# Altium schematic sheet Battery Mgmt Sys - AMS.SchDoc
size A4
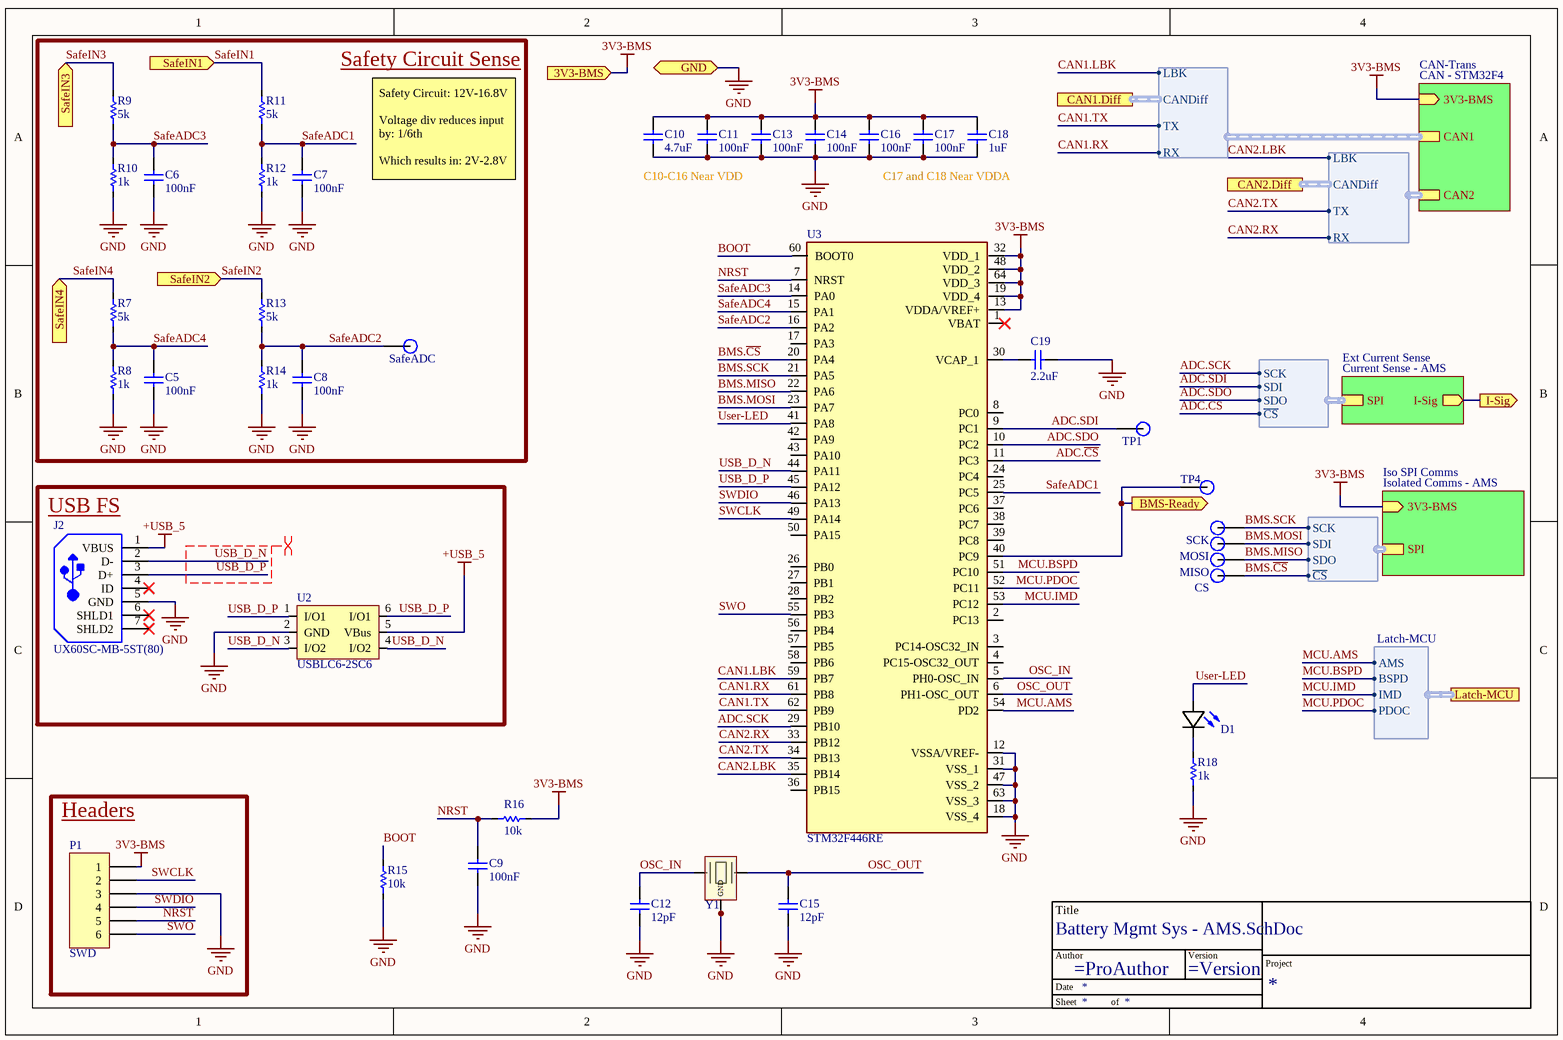
[diagram p0: Battery Mgmt Sys - AMS.SchDoc]

## Parts
*  TitleBlock  (value not drawn)  (graphical)
C5  value 100nF  [C_0603]  (hidden comment: C0603C104K3RAC7013)
C6  value 100nF  [C_0603]  (hidden comment: C0603C104K3RAC7013)
C7  value 100nF  [C_0603]  (hidden comment: C0603C104K3RAC7013)
C8  value 100nF  [C_0603]  (hidden comment: C0603C104K3RAC7013)
C9  value 100nF  [C_0603]  (hidden comment: C0603C104K3RAC7013)
C10  value 4.7uF  [C_0603]  (hidden comment: CL10A475KP8NNNL)
C11  value 100nF  [C_0603]  (hidden comment: C0603C104K3RAC7013)
C12  value 12pF  [0402]  (hidden comment: GCM1555C1H120FA16D)
C13  value 100nF  [C_0603]  (hidden comment: C0603C104K3RAC7013)
C14  value 100nF  [C_0603]  (hidden comment: C0603C104K3RAC7013)
C15  value 12pF  [0402]  (hidden comment: GCM1555C1H120FA16D)
C16  value 100nF  [C_0603]  (hidden comment: C0603C104K3RAC7013)
C17  value 100nF  [C_0603]  (hidden comment: C0603C104K3RAC7013)
C18  value 1uF  [C_0603]  (hidden comment: CL10A105KP8NNNL)
C19  value 2.2uF  [C_0603]  (hidden comment: CL10A225KP8NNNC)
CS  Test Point  [Test Point]  (value not drawn)  (no BOM)
D1  150060BS55040  [LED (0603)]  (value not drawn)
J2  UX60SC-MB-5ST(80)  [HIRO-UX60SC-MB-5ST(80)_V]
MISO  Test Point  [Test Point]  (value not drawn)  (no BOM)
MOSI  Test Point  [Test Point]  (value not drawn)  (no BOM)
P1  SWD  [HDR1X6]  (no BOM)
R7  value 5k  [R-0603]  (hidden comment: CR0603AFX-5101EAS)
R8  value 1k  [R-0603]  (hidden comment: CR0603AFX-1001ELF)
R9  value 5k  [R-0603]  (hidden comment: CR0603AFX-5101EAS)
R10  value 1k  [R-0603]  (hidden comment: CR0603AFX-1001ELF)
R11  value 5k  [R-0603]  (hidden comment: CR0603AFX-5101EAS)
R12  value 1k  [R-0603]  (hidden comment: CR0603AFX-1001ELF)
R13  value 5k  [R-0603]  (hidden comment: CR0603AFX-5101EAS)
R14  value 1k  [R-0603]  (hidden comment: CR0603AFX-1001ELF)
R15  value 10k  [R-0603]  (hidden comment: RC0603FR-1310KL)
R16  value 10k  [R-0603]  (hidden comment: RC0603FR-1310KL)
R18  value 1k  [R-0603]  (hidden comment: CR0603AFX-1001ELF)
SafeADC  Test Point  [Test Point]  (value not drawn)  (no BOM)
SCK  Test Point  [Test Point]  (value not drawn)  (no BOM)
TP1  Test Point  [Test Point]  (value not drawn)  (no BOM)
TP4  Test Point  [Test Point]  (value not drawn)  (no BOM)
U2  USBLC6-2SC6  [USBLC6-2SC6]
U3  STM32F446RE  [QFP50P1200X1200X160-64N]
Y1  CX2016DB26000D0FLJCC  [CX2016DB26000D0FLJCC]  (value not drawn)

## Blocks framed on the sheet
Safety Circuit Sense: C5-C8 R7-R14 SafeADC
USB FS: J2 U2
Headers: P1

## Sub-sheets
CAN-Trans = CAN - STM32F4: CAN2 (harness CAN), CAN1 (harness CAN), 3V3-BMS (in)
Ext Current Sense = Current Sense - AMS: SPI (harness SPI), I-Sig (out)
Iso SPI Comms = Isolated Comms - AMS: SPI (harness SPI), 3V3-BMS (in)

## Ports
3V3-BMS (in), BMS-Ready (out), CAN1.Diff (harness CANDiff), CAN2.Diff (harness CANDiff), GND (bidir), I-Sig (out), Latch-MCU (harness Latch-MCU), SafeIN1 (in), SafeIN2 (in), SafeIN3 (in), SafeIN4 (in)

## Harnesses
SPI: SDI, SDO, ~{CS}, SCK
CAN: LBK, CANDiff, TX, RX
Latch-MCU: AMS, BSPD, IMD, PDOC

## Nets
3V3-BMS: C10.2 C11.2 C13.2 C14.2 C16.2 C17.2 C18.2 P1.1 R16.2 U3.13(VDDA/VREF+) U3.19(VDD_4) U3.32(VDD_1) U3.48(VDD_2) U3.64(VDD_3) ; port 3V3-BMS, sheet CAN-Trans/3V3-BMS, sheet Iso SPI Comms/3V3-BMS
+USB_5: J2.1(VBUS) U2.5(VBus)
GND: C5.1 C6.1 C7.1 C8.1 C9.1 C10.1 C11.1 C12.1 C13.1 C14.1 C15.1 C16.1 C17.1 C18.1 C19.1 J2.5(GND) P1.3 R8.1 R10.1 R12.1 R14.1 R15.1 R18.1 U2.2(GND) U3.12(VSSA/VREF-) U3.18(VSS_4) U3.31(VSS_1) U3.47(VSS_2) U3.63(VSS_3) Y1.2(GND) Y1.4(GND) ; port GND
ADC.~{CS}: U3.11(PC3) ; sheet Ext Current Sense/SPI.~{CS}
ADC.SCK: U3.29(PB10) ; sheet Ext Current Sense/SPI.SCK
ADC.SDI: TP1.1 U3.9(PC1) ; sheet Ext Current Sense/SPI.SDI
ADC.SDO: U3.10(PC2) ; sheet Ext Current Sense/SPI.SDO
BMS-Ready: TP4.1 U3.40(PC9) ; port BMS-Ready
BMS.~{CS}: CS.1 U3.20(PA4) ; sheet Iso SPI Comms/SPI.~{CS}
BMS.MISO: MISO.1 U3.22(PA6) ; sheet Iso SPI Comms/SPI.SDO
BMS.MOSI: MOSI.1 U3.23(PA7) ; sheet Iso SPI Comms/SPI.SDI
BMS.SCK: SCK.1 U3.21(PA5) ; sheet Iso SPI Comms/SPI.SCK
BOOT: R15.2 U3.60(BOOT0)
CAN1.LBK: U3.59(PB7) ; sheet CAN-Trans/CAN1.LBK
CAN1.RX: U3.61(PB8) ; sheet CAN-Trans/CAN1.RX
CAN1.TX: U3.62(PB9) ; sheet CAN-Trans/CAN1.TX
CAN2.LBK: U3.35(PB14) ; sheet CAN-Trans/CAN2.LBK
CAN2.RX: U3.33(PB12) ; sheet CAN-Trans/CAN2.RX
CAN2.TX: U3.34(PB13) ; sheet CAN-Trans/CAN2.TX
I-Sig: port I-Sig, sheet Ext Current Sense/I-Sig
MCU.AMS: U3.54(PD2) ; port Latch-MCU.AMS
MCU.BSPD: U3.51(PC10) ; port Latch-MCU.BSPD
MCU.IMD: U3.53(PC12) ; port Latch-MCU.IMD
MCU.PDOC: U3.52(PC11) ; port Latch-MCU.PDOC
NRST: C9.2 P1.5 R16.1 U3.7(NRST)
OSC_IN: C12.2 U3.5(PH0-OSC_IN) Y1.1
OSC_OUT: C15.2 U3.6(PH1-OSC_OUT) Y1.3
SafeADC1: C7.2 R11.1 R12.2 U3.25(PC5)
SafeADC2: C8.2 R13.1 R14.2 SafeADC.1 U3.16(PA2)
SafeADC3: C6.2 R9.1 R10.2 U3.14(PA0)
SafeADC4: C5.2 R7.1 R8.2 U3.15(PA1)
SafeIN1: R11.2 ; port SafeIN1
SafeIN2: R13.2 ; port SafeIN2
SafeIN3: R9.2 ; port SafeIN3
SafeIN4: R7.2 ; port SafeIN4
SWCLK: P1.2 U3.49(PA14)
SWDIO: P1.4 U3.46(PA13)
SWO: P1.6 U3.55(PB3)
USB_D_N: J2.2(D-) U2.3(I/O2) U2.4(I/O2) U3.44(PA11)
USB_D_P: J2.3(D+) U2.1(I/O1) U2.6(I/O1) U3.45(PA12)
User-LED: D1.2(A) U3.41(PA8)
NetC19_2: C19.2 U3.30(VCAP_1)
NetD1_1: D1.1(K) R18.2

Not connected (* = marked no-connect by the designer): J2 4(ID)* 6(SHLD1)* 7(SHLD2)*; U3 1(VBAT)* 2(PC13) 3(PC14-OSC32_IN) 4(PC15-OSC32_OUT) 8(PC0) 17(PA3) 24(PC4) 26(PB0) 27(PB1) 28(PB2) 36(PB15) 37(PC6) 38(PC7) 39(PC8) 42(PA9) 43(PA10) 50(PA15) 56(PB4) 57(PB5) 58(PB6)

## Layout directives
differential pair; net class USB_Diff: USB_D_N, USB_D_P

## Notes on the sheet
- Safety Circuit: 12V-16.8V
  Voltage div reduces input by: 1/6th
  Which results in: 2V-2.8V
- C10-C16 Near VDD
- C17 and C18 Near VDDA
- (in symbol TitleBlock) Title; Author; Version; Project; Date; Sheet; of

## Library data of the parts
C5-C19 = Capacitor: ComponentLink1Description: New link; ComponentLink1URL: *
CS MISO MOSI SafeADC SCK TP1 TP4 = Test Point: 1.2mm Test point
D1 = 150060BS55040: LED BLUE DIFFUSED 0603 SMD; Manufacturer: Wurth Electronics; Lens Style: Flat; Luminous Intensity: 80mcd; Forward Voltage: 3.2V; Test Current: 20mA; Viewing Angle: 140°; Dominant Wavelength: 470nm; Lens Size: 0.8mm; Supplier 1: Mouser; Manufacturer Part Number: 150060BS55040; RoHS: No; Pricing 1: 1=0.18000, 10=0.16800, 50=0.16800, 100=0.15200, 1000=0.12100, 10000=0.10600 (USD); Mount: Surface Mount; Case/Package: 0603; Color: Blue; Packaging: Tape and Reel; Lens Transparency: Diffused; Length: 1.6mm; Width: 0.8mm; Height: 0.5mm; RoHS Compliant: No; ComponentLink1URL: http://www.farnell.com/datasheets/2621640.pdf?src-supplier=Farnell; ComponentLink1Description: http://www.farnell.com/datasheets/2621640.pdf?src-supplier=Farnell; ComponentLink2URL: https://www.we-online.de/web/en/index.php/download/media/07_electronic_components/download_center_1/application_notes_berichte/ano002_leds___the_future_of_horticultural_lighting/ANO002b_EN_LEDs_The_Future_of_Horticultural_Lighting.pdf?src-supplier=Digi-Key; ComponentLink2Description: https://www.we-online.de/web/en/index.php/download/media/07_electronic_components/download_center_1/application_notes_berichte/ano002_leds___the_future_of_horticultural_lighting/ANO002b_EN_LEDs_The_Future_of_Horticultural_Lighting.pdf?src-supplier=Digi-Key; ComponentLink3URL: https://katalog.we-online.de/pbs/datasheet/150060BS55040.pdf?src-supplier=Digi-Key; ComponentLink3Description: https://katalog.we-online.de/pbs/datasheet/150060BS55040.pdf?src-supplier=Digi-Key; ComponentLink4URL: http://www.farnell.com/datasheets/2621640.pdf?src-supplier=Newark; ComponentLink4Description: http://www.farnell.com/datasheets/2621640.pdf?src-supplier=Newark; Supplier Part Number 1: 710-150060BS55040
J2 = CMP-2000-07376-1: Mini-B Connector, SMT Mount Receptacle Meeting Requirement of USB 2.0 Standard, 5 V, 1 A, -30 to 75 degC, 5-Pin SMD, RoHS, Tape and Reel; Manufacturer: Hirose Electric; Product Length (mm): 7.7mm; Voltage Rating Max: 5VAC; Number of Contacts: 5POS; Number of Ports: 1Port; Product Height (mm): 3.95mm; Product Depth (mm): 7mm; Pitch (mm): 0.8mm; Gender: RCP; Current Rating (Max): 1A; DELETED: Compliant; Product Diameter (mm): NotRequiredmm; Body Orientation: RightAngle; Operating Temp Range: -30Cto75C; Packaging: TapeandReel; Termination Method: Solder; Number of Terminals: 5; Package Description: 5-Pin Surface Mount Device, Body 7.7 x 7 mm, Pitch 0.8 mm; Mounting Technology: SurfaceMount; Contact Material: CopperAlloy; Package Reference: UX60SC-MB-5ST(80); Operating Temperature Min Deg. C: -30C; Housing Material: Synthetic; Operating Temperature Max Deg. C: 75C; Manufacturer URL: https://www.hirose.com; Datasheet Version: 04/2008; Type: Mini-USB; Datasheet URL: https://datasheet.ciiva.com/4598/e24000153-34949-4598883.pdf; Contact Plating: Gold; Mounting Style: ThroughHole
P1 = Header 6: Header, 6-Pin; LatestRevisionDate: 17-Jul-2002; LatestRevisionNote: Re-released for DXP Platform.; Publisher: Altium Limited
R7 R9 R11 R13 R15 R16 R18 = Resistor
R8 R10 R12 R14 = Resistor: Voltage divider
U2 = USBLC6-2SC6: TVS DIODE 5.25V 17V SOT23-6; Manufacturer: STMicroelectronics; Direction: Unidirectional,Bidirectional; Capacitance: 3.5pF; Operating Supply Voltage: 1.1V; Number of Channels: 2; Breakdown Voltage: 6V; Power Line Protection: Yes; Test Current: 1mA; Max Reverse Leakage Current: 150nA; Peak Pulse Current: 5A; Element Configuration: Dual; Data Rate: 480Mbps; Number of Elements: 1; Working Voltage: 5V; Supplier 1: RSComponents; Manufacturer Part Number: USBLC6-2SC6; RoHS: Yes; Category: TVS Diodes; Stock 1: 1; Pricing 1: 10=0.61400, 50=0.57700, 100=0.54700, 250=0.51600, 500=0.49000 (USD); Mount: Surface Mount; Case/Package: SOT-23; Number of Pins: 6; Contact Plating: Tin,Matte; Min Operating Temperature: -40°C; Max Operating Temperature: 125°C; Clamping Voltage: 17V; Packaging: Tape and Reel; Package Quantity: 3000; Termination: SMD/SMT; Number of Bidirectional Channels: 2; Reverse Standoff Voltage: 5.25V; Min Breakdown Voltage: 6V; ESD Protection: Yes; Leakage Current: 150nA; Series: USB; Reverse Breakdown Voltage: 6V; Polarity: Unidirectional,Bidirectional; Max Breakdown Voltage: 6V; Clamping Voltage-Max: 17V; Length: 3.05mm; Width: 1.75mm; Height: 1.3mm; Depth: 1.75mm; Radiation Hardening: No; REACH SVHC: No SVHC; Lead Free: Lead Free; RoHS Compliant: Yes; ComponentLink1URL: https://datasheet.ciiva.com/1268/1690354-1268384.pdf?src-supplier=Element14; ComponentLink1Description: https://datasheet.ciiva.com/1268/1690354-1268384.pdf?src-supplier=Element14; ComponentLink2URL: https://datasheet.ciiva.com/4508/cd00050750-113117-4508433.pdf?src-supplier=Mouser; ComponentLink2Description: https://datasheet.ciiva.com/4508/cd00050750-113117-4508433.pdf?src-supplier=Mouser; ComponentLink3URL: https://datasheet.ciiva.com/15143/getdatasheetpartid-148465-15143789.pdf?src-supplier=Verical; ComponentLink3Description: https://datasheet.ciiva.com/15143/getdatasheetpartid-148465-15143789.pdf?src-supplier=Verical; ComponentLink4URL: https://datasheet.ciiva.com/26787/usblc6-2sc6-26787908.pdf?src-supplier=IIIC; ComponentLink4Description: https://datasheet.ciiva.com/26787/usblc6-2sc6-26787908.pdf?src-supplier=IIIC; ComponentLink5URL: https://datasheet.ciiva.com/16200/cd00050750-16200026.pdf?src-supplier=Future+Electronics; ComponentLink5Description: https://datasheet.ciiva.com/16200/cd00050750-16200026.pdf?src-supplier=Future+Electronics; ComponentLink6URL: https://datasheet.ciiva.com/41444/001184109-da-01-en-ic-esd-protecti-usblc6-2sc6-sot-23-6-stm-41444156.pdf?src-supplier=Conrad; ComponentLink6Description: https://datasheet.ciiva.com/41444/001184109-da-01-en-ic-esd-protecti-usblc6-2sc6-sot-23-6-stm-41444156.pdf?src-supplier=Conrad; Supplier Part Number 1: 6247693
U3 = STM32F446RE: 32 Bit Microcontroller, High Performance, ARM Cortex-M4, 180 MHz, 256 KB, 128 KB, 64, LQFP; MP: STM32F446RE; Value: *
Y1 = CX2016DB26000D0FLJCC: Crystals AEC-Q200 26000kHz 8pF 2x1.6mm